# EAGLE schematic BSPD (EAGLE 8.4.1)
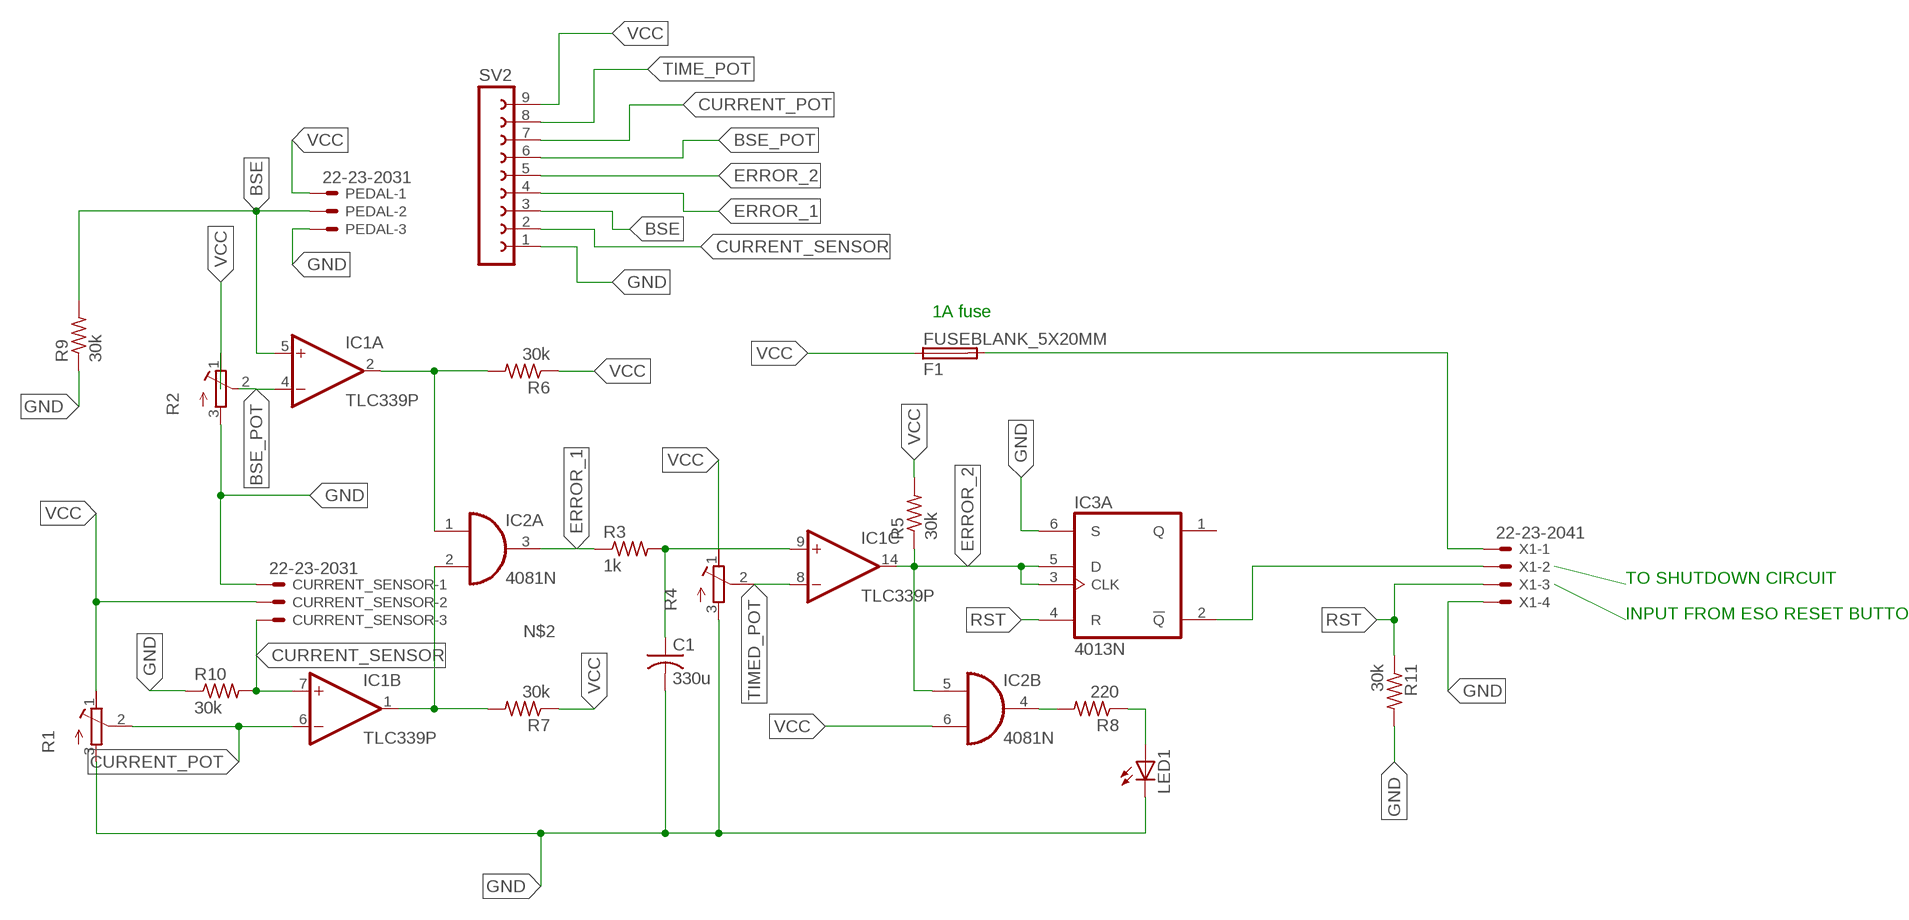
[diagram p0: schematic, sheet 1]

## Parts
C1  330u  C-US225-108X268  [C225-108X268]
CURRENT_SENSOR  22-23-2031  [22-23-2031]
F1  FUSEBLANK_5X20MM  [FUSE_HOLDER_5X20MM]
IC1  TLC339P  [DIL14]
IC2  4081N  [DIL14]
IC3  4013N  [DIL14]
LED1  LED5MM  [LED5MM]
PEDAL  22-23-2031  [22-23-2031]
R1  R-TRIMM3006P  [RTRIM3006P]
R2  R-TRIMM43P  [RTRIM43P]
R3  1k  R-US_0207/12  [0207/12]
R4  R-TRIMM3006P  [RTRIM3006P]
R5  30k  R-US_0207/12  [0207/12]
R6  30k  R-US_0207/12  [0207/12]
R7  30k  R-US_0207/12  [0207/12]
R8  220  R-US_0207/12  [0207/12]
R9  30k  R-US_0207/12  [0207/12]
R10  30k  R-US_0207/12  [0207/12]
R11  30k  R-US_0207/12  [0207/12]
SV2  FE09W  [FE09W]
X1  22-23-2041  [22-23-2041]

## Nets
BSE: IC1.5(A:+IN) PEDAL.2 R9.2 SV2.3
BSE_POT: IC1.4(A:-IN) R2.2(S) SV2.6
CURRENT_POT: IC1.6(B:-IN) R1.2(S) SV2.7
CURRENT_SENSOR: CURRENT_SENSOR.3 IC1.7(B:+IN) R10.2 SV2.2
ERROR_1: IC2.3(A:O) R3.1 SV2.4
ERROR_2: IC1.14(C:OUT) IC2.5(B:I0) IC3.3(A:CLK) IC3.5(A:D) R5.1 SV2.5
GND: C1.2 CURRENT_SENSOR.1 IC3.6(A:S) LED1.K(C) PEDAL.3 R1.3(A) R2.3(A) R4.3(A) R9.1 R10.1 R11.2 SV2.1 X1.4
N$1: IC1.2(A:OUT) IC2.1(A:I0) R6.2
N$2: IC1.1(B:OUT) IC2.2(A:I1) R7.2
N$3: IC3.2(A:!Q) X1.2
N$4: F1.2 X1.1
N$6: C1.1 IC1.9(C:+IN) R3.2
N$16: IC2.4(B:O) R8.2
N$17: LED1.A R8.1
RST: IC3.4(A:R) R11.1 X1.3
TIME_POT: SV2.8
TIMED_POT: IC1.8(C:-IN) R4.2(S)
VCC: CURRENT_SENSOR.2 F1.1 IC2.6(B:I1) PEDAL.1 R1.1(E) R2.1(E) R4.1(E) R5.2 R6.1 R7.1 SV2.9
Unconnected: IC1.10(D:-IN) IC1.11(D:+IN) IC1.13(D:OUT) IC2.8(C:I0) IC2.9(C:I1) IC2.10(C:O) IC2.11(D:O) IC2.12(D:I0) IC2.13(D:I1) IC3.1(A:Q) IC3.8(B:S) IC3.9(B:D) IC3.10(B:R) IC3.11(B:CLK) IC3.12(B:!Q) IC3.13(B:Q)

## Notes on the sheet
- 1A fuse
- TO SHUTDOWN CIRCUIT
- INPUT FROM ESO RESET BUTTON

## Power pins joined to a net without a drawn wire
V+: IC1.3(P:V+)
V-: IC1.12(P:V-)
VDD: IC2.14(P:VDD) IC3.14(P:VDD)
VSS: IC2.7(P:VSS) IC3.7(P:VSS)

## Library data of the parts
C1 = rcl:C-US: CAPACITOR, American symbol; SPICEPREFIX: C
CURRENT_SENSOR PEDAL = con-molex:22-23-2031: .100" (2.54mm) Center Header - 3 Pin; MF: MOLEX; MPN: 22-23-2031; OC_FARNELL: 1462950; OC_NEWARK: 30C0862
F1 = fuse:FUSE: Fuse; OC_FARNELL: unknown; OC_NEWARK: unknown
IC1 = linear:TLC339: COMPARATOR
IC2 = 40xx:4081: Quad 2-input AND
IC3 = 40xx:4013: Dual D FLIP FLOP, set/reset
LED1 = led:LED: LED OSRAM: - CHIPLED LG R971, LG N971, LY N971, LG Q971, LY Q971, LO R971, LY R971 LH N974, LH R974 LS Q976, LO Q976, LY Q976 LO Q996 - Hyper CHIPLED LW Q18S LB Q993, LB Q99A, LB R99A - SideLED LS A670, LO A670, LY A670, LG A670, LP A670 LB A673, LV A673, LT A673, LW A673 LH A674 LY A675 LS A676, LA A676, LO A676, LY A676, LW A676 LS A679, LY A679, LG A679 - Hyper Micro SIDELED® LS Y876, LA Y876, LO Y876, LY Y876 LT Y87S - SmartLED LW L88C, LW L88S LB L89C, LB L89S, LG L890 LS L89K, LO L89K, LY L89K LS L896, LA L896, LO L896, LY L896 - TOPLED LS T670, LO T670, LY T670, LG T670, LP T670 LSG T670, LSP T670, LSY T670, LOP T670, LYG T670 LG T671, LOG T671, LSG T671 LB T673, LV T673, LT T673, LW T673 LH T674 LS T676, LA T676, LO T676, LY T676, LB T676, LH T676, LSB T676, LW T676 LB T67C, LV T67C, LT T67C, LS T67K, LO T67K, LY T67K, LW E67C LS E67B, LA E67B, LO E67B, LY E67B, LB E67C, LV E67C, LT E67C LW T67C LS T679, LY T679, LG T679 LS T770, LO T770, LY T770, LG T770, LP T770 LB T773, LV T773, LT T773, LW T773 LH T774 LS E675, LA E675, LY E675, LS T675 LS T776, LA T776, LO T776, LY T776, LB T776 LHGB T686 LT T68C, LB T68C - Hyper Mini TOPLED® LB M676 - Mini TOPLED Santana® LG M470 LS M47K, LO M47K, LY M47K Source: http://www.osram.convergy.de LUXEON: - LUMILED® LXK2-PW12-R00, LXK2-PW12-S00, LXK2-PW14-U00, LXK2-PW14-V00 LXK2-PM12-R00, LXK2-PM12-S00, LXK2-PM14-U00 LXK2-PE12-Q00, LXK2-PE12-R00, LXK2-PE12-S00, LXK2-PE14-T00, LXK2-PE14-U00 LXK2-PB12-K00, LXK2-PB12-L00, LXK2-PB12-M00, LXK2-PB14-N00, LXK2-PB14-P00, LXK2-PB14-Q00 LXK2-PR12-L00, LXK2-PR12-M00, LXK2-PR14-Q00, LXK2-PR14-R00 LXK2-PD12-Q00, LXK2-PD12-R00, LXK2-PD12-S00 LXK2-PH12-R00, LXK2-PH12-S00 LXK2-PL12-P00, LXK2-PL12-Q00, LXK2-PL12-R00 Source: www.luxeon.com KINGBRIGHT: KA-3528ASYC Source: www.kingbright.com
R1 R2 R4 = rcl:R-TRIMM: Trimm resistor; SPICEMODEL: X; SPICEPREFIXL: POT
R3 R5-R11 = rcl:R-US_: RESISTOR, American symbol; SPICEPREFIX: R
SV2 = con-lsta:FE09W: FEMALE HEADER; OC_FARNELL: unknown; OC_NEWARK: unknown
X1 = con-molex:22-23-2041: .100" (2.54mm) Center Header - 4 Pin; MF: MOLEX; MPN: 22-23-2041; OC_FARNELL: 1462920; OC_NEWARK: 38C0355